# Altium schematic sheet Temperature.SchDoc: Temperature sense
size A3; Organization: ORGANIZATION; Address1: ADDRESS 1; Address2: ADDRESS 2; Address3: ADDRESS 3; Address4: ADDRESS 4; Revision: 0.0; SheetNumber: 18; SheetTotal: 19; ENG_APP_DATE: --/--/--; DSN_APP_DATE: --/--/--; CHK_APP_DATE: --/--/--
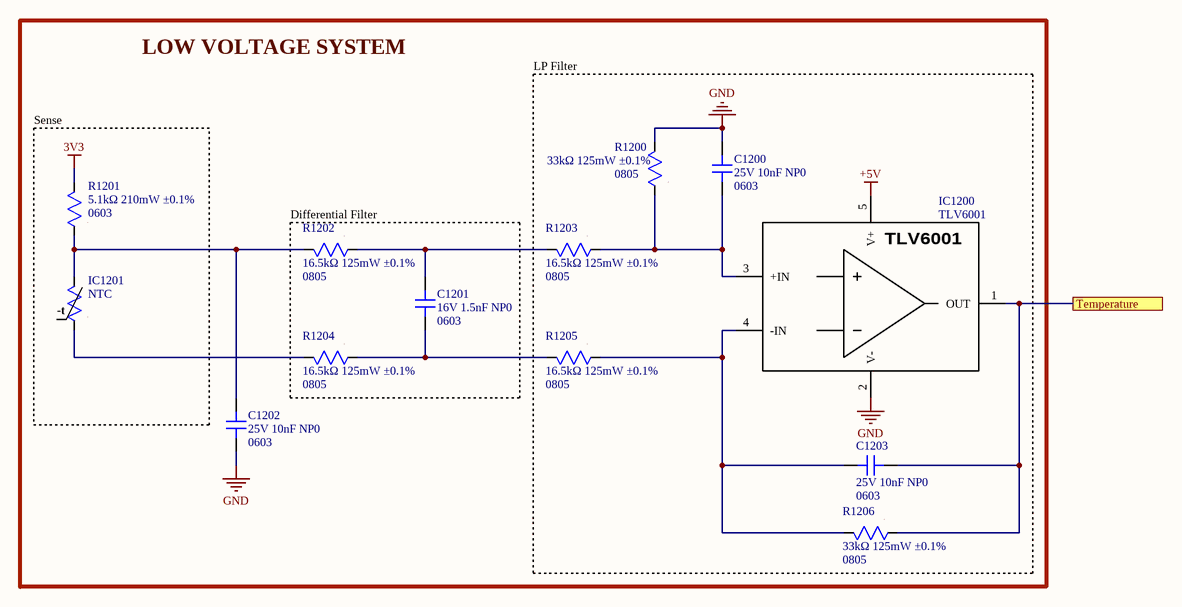
[diagram p0: Temperature.SchDoc]

## Parts
C1200  value 25V 10nF NP0  Package: 0603  [CAP SMD 0603]  (hidden comment: CAP non polarized)
C1201  value 16V 1.5nF NP0  Package: 0603  [CAP SMD 0603]  (hidden comment: CAP non polarized)
C1202  value 25V 10nF NP0  Package: 0603  [CAP SMD 0603]  (hidden comment: CAP non polarized)
C1203  value 25V 10nF NP0  Package: 0603  [CAP SMD 0603]  (hidden comment: CAP non polarized)
IC1200  TLV6001  [SOT-23-5]
IC1201  NTC  [RES SMD 0603]
R1200  value 33kΩ 125mW ±0.1%  Package: 0805  [RES SMD 0805]  (hidden comment: RES)
R1201  value 5.1kΩ 210mW ±0.1%  Package: 0603  [RES SMD 0603]  (hidden comment: RES)
R1202  value 16.5kΩ 125mW ±0.1%  Package: 0805  [RES SMD 0805]  (hidden comment: RES)
R1203  value 16.5kΩ 125mW ±0.1%  Package: 0805  [RES SMD 0805]  (hidden comment: RES)
R1204  value 16.5kΩ 125mW ±0.1%  Package: 0805  [RES SMD 0805]  (hidden comment: RES)
R1205  value 16.5kΩ 125mW ±0.1%  Package: 0805  [RES SMD 0805]  (hidden comment: RES)
R1206  value 33kΩ 125mW ±0.1%  Package: 0805  [RES SMD 0805]  (hidden comment: RES)

## Blocks framed on the sheet
LOW VOLTAGE SYSTEM: C1202
LP Filter: C1200 C1203 IC1200 R1200 R1203 R1205 R1206
Sense: IC1201 R1201
Differential Filter: C1201 R1202 R1204

## Ports
Temperature

## Nets
3V3: R1201.2
+5V: IC1200.5(V+)
GND: C1200.2 C1202.2 IC1200.2(V-) R1200.2
Temperature: C1203.2 IC1200.1(OUT) R1206.1 ; port Temperature
NetC1200_1: C1200.1 IC1200.3(+IN) R1200.1 R1203.1
NetC1201_1: C1201.1 R1202.1 R1203.2
NetC1201_2: C1201.2 R1204.1 R1205.2
NetC1202_1: C1202.1 IC1201.2 R1201.1 R1202.2
NetC1203_1: C1203.1 IC1200.4(-IN) R1205.1 R1206.2
NetIC1201_1: IC1201.1 R1204.2

## Notes on the sheet
- Project:
- Subsystem:
- Company:
- Document:
- Author:
- Revision:
- Date:
- Sheet:
- /
- (in symbol 060-0002) -t

## Library data of the parts
C1200 C1203 = 001-0107: Condensadores de cerámica multicapa (MLCC- SMD/SMT) 0.01 uF 25 VDC 1% 0603 C0G (NP0) AEC-Q200; MPN: GRT1885C1E103FA02D; Manufacturer: muRata; ComponentLink1Description: Datasheet; ComponentLink1URL: https://www.mouser.es/datasheet/3/76/2/GRT1885C1E103FA02_01A.pdf; ComponentLink2Description: Distributor Link; ComponentLink2URL: https://www.mouser.es/ProductDetail/Murata-Electronics/GRT1885C1E103FA02D?qs=xZ%2FP%252Ba9zWqaqiXqJj78%252Bmg%3D%3D; ID: 001-0107; Distributor PN: 81-GRT1885C1E103FA2D; Distributor: Mouser
C1201 = 001-0121: Condensadores de cerámica multicapa (MLCC- SMD/SMT) 25V 1500pF C0G 0603 1%; MPN: C0603C152F3GECTU; Manufacturer: KEMET; ComponentLink1Description: Datasheet; ComponentLink1URL: https://www.mouser.es/datasheet/3/508/1/KEM_C1091_C0G_ESD.pdf; ComponentLink2Description: Distributor Link; ComponentLink2URL: https://www.mouser.es/ProductDetail/KEMET/C0603C152F3GECTU?qs=Mv7BduZupUh%252Bk5D8ZWarTg%3D%3D; ID: 001-0121; Distributor PN: 80-C0603C152F3GEC; Distributor: Mouser
C1202 = 001-0109: Condensadores de cerámica multicapa (MLCC- SMD/SMT) 50V 5100pF 0603 C0G 1%; MPN: C0603C512F5GACTU; Manufacturer: KEMET; ComponentLink1Description: Datasheet; ComponentLink1URL: https://www.mouser.es/datasheet/3/72/1/C0603C512F5GACTU.pdf; ComponentLink2Description: Distributor Link; ComponentLink2URL: https://www.mouser.es/ProductDetail/KEMET/C0603C512F5GACTU?qs=Fn3VdHBzkcmgqbeAGPfrXg%3D%3D; ID: 001-0109; Distributor PN: 80-C0603C512F5G; Distributor: Mouser
IC1200 = 062-0002: Amplificadores operacionales - Op Amps Single 5.5-V 1-MHz R RIO operational a A A 595-TLV6001UIDBVT; MPN: TLV6001UIDBVR; Manufacturer: Texas Instruments; ID: 062-0002; ComponentLink1URL: https://www.ti.com/lit/ds/symlink/tlv6001.pdf?ts=1781607824916&ref_url=https%253A%252F%252Fcz.mouser.com%252F; ComponentLink2URL: https://www.mouser.es/ProductDetail/Texas-Instruments/TLV6001UIDBVR?qs=8N88piwwHEgntIgM8jjJ5Q%3D%3D; Value: -; Package: SOT-23-5; Distributor PN: 595-TLV6001UIDBVR; Distributor: Mouser
IC1201 = 060-0002: Termistores NTC 10Kohms 1% SMD; MPN: NTCS0603E3103FLT; Manufacturer: Vishay; Value: 10kΩ 125mW ±1%; ComponentLink1Description: Datasheet; ComponentLink1URL: https://www.vishay.com/docs/29056/ntcs0603e3t.pdf; ComponentLink2Description: Distributor Link; ComponentLink2URL: https://www.mouser.es/ProductDetail/Vishay-BC-Components/NTCS0603E3103FLT?qs=%2FWiulJ9oly66lfIcr%252B1Bpw%3D%3D; ID: 060-0002; Package: 0603; Distributor PN: 594-NTCS0603E3103FLT; Distributor: Mouser
R1200 R1206 = 010-0169: Thin Film Resistors 0805 33Kohm 0.1% 15ppm AEC-Q200; MPN: ERA-6APB333V; Manufacturer: Panasonic; ComponentLink1Description: Datasheet; ComponentLink1URL: https://industrial.panasonic.com/cdbs/www-data/pdf/RDM0000/AOA0000C307.pdf; ComponentLink2Description: Distributor Link; ComponentLink2URL: https://www.mouser.es/ProductDetail/Panasonic/ERA-6APB333V?qs=sGAEpiMZZMvdGkrng054t7Q%2FBjLwFmgi3idxPYTcWw0%3D; ID: 010-0169; Distributor PN: 667-ERA-6APB333V; Distributor: Mouser
R1201 = 010-0176: Thin Film Resistors 5.1Kohms 0.1% 10ppm; MPN: TNPW06035K10BYEN; Manufacturer: Vishay; ComponentLink1Description: Datasheet; ComponentLink1URL: https://www.vishay.com/docs/28758/tnpw_e3.pdf; ComponentLink2Description: Distributor Link; ComponentLink2URL: https://www.mouser.es/ProductDetail/Vishay/TNPW06035K10BYEN?qs=sGAEpiMZZMvdGkrng054t1oDJztsiizWD%252B5sENOdKiv4hhjUJDCTXQ%3D%3D; ID: 010-0176; Distributor PN: 71-TNPW06035K10BYEN; Distributor: Mouser
R1202-R1205 = 010-0167: Thin Film Resistors 0805 Thin film chip resistor; MPN: ERA-6ARB1652V; Manufacturer: Panasonic; ComponentLink1Description: Datasheet; ComponentLink1URL: https://industrial.panasonic.com/cdbs/www-data/pdf/RDM0000/AOA0000C307.pdf; ComponentLink2Description: Distributor Link; ComponentLink2URL: https://www.mouser.es/ProductDetail/Panasonic/ERA-6ARB1652V?qs=sGAEpiMZZMvdGkrng054t%2FDNinWxsEFqx8wKlfWZmnLEWdfrAdOy9w%3D%3D; ID: 010-0167; Distributor PN: 667-ERA-6ARB1652V; Distributor: Mouser